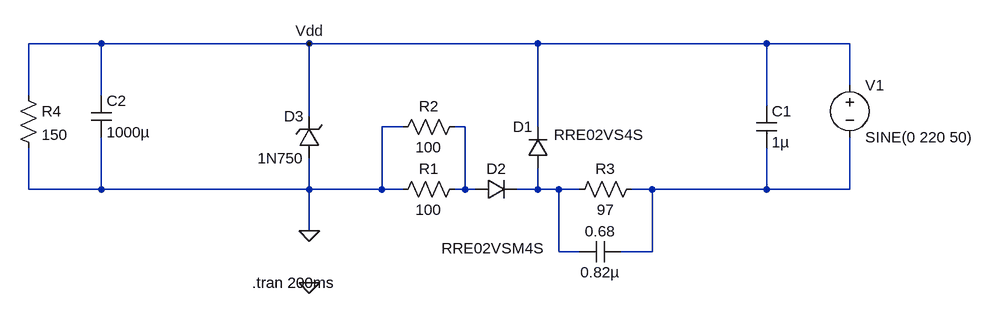
[diagram p0: schematic power.asc]
power.asc, the LTspice schematic file:
Version 4
SHEET 1 880 680
WIRE -592 -96 -704 -96
WIRE -272 -96 -592 -96
WIRE 80 -96 -272 -96
WIRE 432 -96 80 -96
WIRE 560 -96 432 -96
WIRE 560 -32 560 -96
WIRE -704 -16 -704 -96
WIRE -592 -16 -592 -96
WIRE 432 0 432 -96
WIRE -272 16 -272 -96
WIRE -128 32 -160 32
WIRE -32 32 -48 32
WIRE 80 32 80 -96
WIRE -704 128 -704 64
WIRE -592 128 -592 48
WIRE -592 128 -704 128
WIRE -272 128 -272 80
WIRE -272 128 -592 128
WIRE -160 128 -160 32
WIRE -160 128 -272 128
WIRE -128 128 -160 128
WIRE -32 128 -32 32
WIRE -32 128 -48 128
WIRE -16 128 -32 128
WIRE 80 128 80 96
WIRE 80 128 48 128
WIRE 112 128 80 128
WIRE 144 128 112 128
WIRE 256 128 224 128
WIRE 432 128 432 64
WIRE 432 128 256 128
WIRE 560 128 560 48
WIRE 560 128 432 128
WIRE -272 192 -272 128
WIRE 112 224 112 128
WIRE 144 224 112 224
WIRE 256 224 256 128
WIRE 256 224 208 224
FLAG -272 192 0
FLAG -272 272 0
FLAG -272 -96 Vdd
SYMBOL cap 416 0 R0
SYMATTR InstName C1
SYMATTR Value 1µ
SYMATTR SpiceLine V=50 Irms=3.41 Rser=0.0133158 Lser=0 mfg="KEMET" pn="C1206C105K5RAC" type="X7R"
SYMBOL cap 208 208 R90
WINDOW 0 0 32 VBottom 2
WINDOW 3 32 32 VTop 2
SYMATTR InstName 0.68
SYMATTR Value 0.82µ
SYMATTR SpiceLine V=200 Irms=5.01 Rser=0.0242154 Lser=0 mfg="KEMET" pn="C2220C824K2RAC" type="X7R"
SYMBOL res -32 112 R90
WINDOW 0 0 56 VBottom 2
WINDOW 3 32 56 VTop 2
SYMATTR InstName R1
SYMATTR Value 100
SYMBOL res -32 16 R90
WINDOW 0 0 56 VBottom 2
WINDOW 3 32 56 VTop 2
SYMATTR InstName R2
SYMATTR Value 100
SYMBOL res 240 112 R90
WINDOW 0 0 56 VBottom 2
WINDOW 3 32 56 VTop 2
SYMATTR InstName R3
SYMATTR Value 97
SYMBOL diode 96 96 R180
WINDOW 0 24 64 Left 2
WINDOW 3 -147 52 Left 2
SYMATTR InstName D1
SYMATTR Value RRE02VS4S
SYMBOL diode -16 144 R270
WINDOW 0 32 32 VTop 2
WINDOW 3 -59 27 VBottom 2
SYMATTR InstName D2
SYMATTR Value RRE02VSM4S
SYMBOL zener -256 80 R180
WINDOW 0 24 64 Left 2
WINDOW 3 24 0 Left 2
SYMATTR InstName D3
SYMATTR Value 1N750
SYMATTR Description Diode
SYMATTR Type diode
SYMBOL voltage 560 -48 R0
WINDOW 123 0 0 Left 0
WINDOW 39 0 0 Left 0
SYMATTR InstName V1
SYMATTR Value SINE(0 220 50)
SYMBOL cap -608 -16 R0
SYMATTR InstName C2
SYMATTR Value 1000µ
SYMBOL res -720 -32 R0
SYMATTR InstName R4
SYMATTR Value 150
TEXT -360 272 Left 2 !.tran 200ms

The netlist it stands for:
* power.asc
C1 Vdd N003 1µ V=50 Irms=3.41 Rser=0.0133158 Lser=0 mfg="KEMET" pn="C1206C105K5RAC" type="X7R"
C§0.68 N003 N002 0.82µ V=200 Irms=5.01 Rser=0.0242154 Lser=0 mfg="KEMET" pn="C2220C824K2RAC" type="X7R"
R1 N001 0 100
R2 N001 0 100
R3 N003 N002 97
D1 N002 Vdd RRE02VS4S
D2 N001 N002 RRE02VSM4S
D3 0 Vdd 1N750
V1 Vdd N003 SINE(0 220 50)
C2 Vdd 0 1000µ
R4 Vdd 0 150
.model D D
.lib standard.dio
.tran 200ms
.backanno
.end